# EAGLE schematic schematic (EAGLE 6.5.0)
DEVICES: DockStation
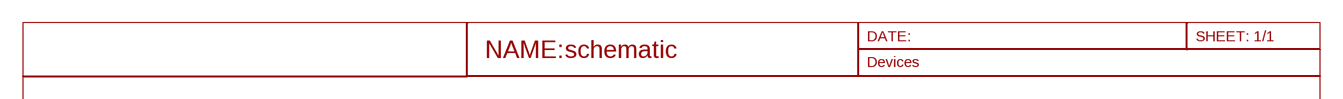
[diagram p0: schematic, sheet 1, part 1 of 2]
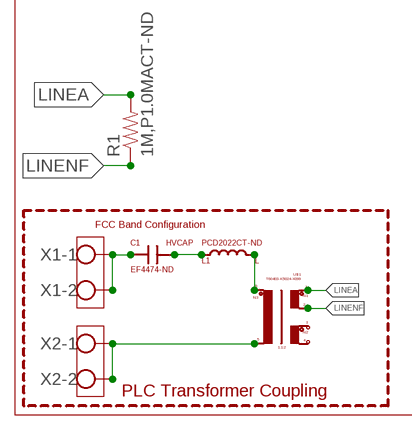
[diagram p1: schematic, sheet 1, part 2 of 2]

## Parts
C1  EF4474-ND  [BAGPACK185781715]
L1  PCD2022CT-ND  [PCC_INDUCTOR_NONSTANDARD]
R1  1M,P1.0MACT-ND  RESISTOR0805-RES  [0805]
U$1  T60403-K5024-X099  [PLCTRNSFTI_PADPOSITION]
X1  W237-102  [W237-102]
X2  W237-102  [W237-102]

## Nets
LINEA: R1.2 U$1.P1
LINENF: R1.1 U$1.P2
N$1: C1.P$2 L1.P$1
N$2: C1.P$1 X1.1 X1.2
N$3: L1.P$2 U$1.P8
N$11: U$1.P5 X2.1 X2.2
Unconnected: U$1.P3 U$1.P4

## Notes on the sheet
- FCC Band Configuration
- PLC Transformer Coupling

## Library data of the parts
C1 = plc_lib:EF4474-ND
L1 = plc_lib:PCD2022CT-ND
R1 = SparkFun-Resistors:RESISTOR: Resistor Basic schematic elements and footprints for 0603, 1206, and PTH resistors.
U$1 = plc_lib:T60403-K5024-X099
X1 X2 = con-wago-500:W237-102: WAGO SCREW CLAMP; MPN: 237-102; OC_FARNELL: unknown; OC_NEWARK: 70K9898